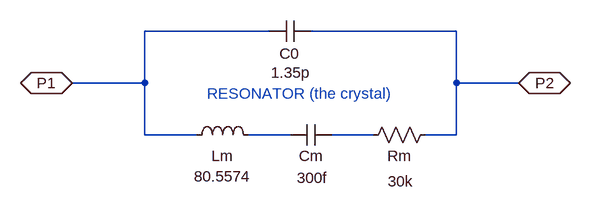
[diagram p0: schematic xtl32.asc]
xtl32.asc, the LTspice schematic file:
Version 4.1
SHEET 1 1628 1552
WIRE -528 0 -720 0
WIRE -240 0 -464 0
WIRE -720 80 -720 0
WIRE -720 80 -832 80
WIRE -240 80 -240 0
WIRE -144 80 -240 80
WIRE -720 160 -720 80
WIRE -640 160 -720 160
WIRE -496 160 -560 160
WIRE -368 160 -432 160
WIRE -240 160 -240 80
WIRE -240 160 -288 160
FLAG -144 80 P2
IOPIN -144 80 BiDir
FLAG -832 80 P1
IOPIN -832 80 BiDir
SYMBOL ind -656 176 R270
WINDOW 0 -32 56 VTop 2
WINDOW 3 -32 56 VBottom 2
SYMATTR InstName Lm
SYMATTR Value 80.5574
SYMBOL cap -496 176 R270
WINDOW 0 -32 32 VTop 2
WINDOW 3 -35 34 VBottom 2
SYMATTR InstName Cm
SYMATTR Value 300f
SYMBOL res -384 176 R270
WINDOW 0 -32 56 VTop 2
WINDOW 3 -40 58 VBottom 2
SYMATTR InstName Rm
SYMATTR Value 30k
SYMBOL cap -528 16 R270
WINDOW 0 -34 31 VTop 2
WINDOW 3 -32 33 VBottom 2
SYMATTR InstName C0
SYMATTR Value 1.35p
TEXT -624 96 Left 2 ;RESONATOR (the crystal)

The netlist it stands for:
* xtl32.asc
Lm P1 N001 80.5574
Cm N001 N002 300f
Rm N002 P2 30k
C0 P1 P2 1.35p
* RESONATOR (the crystal)
.backanno
.end